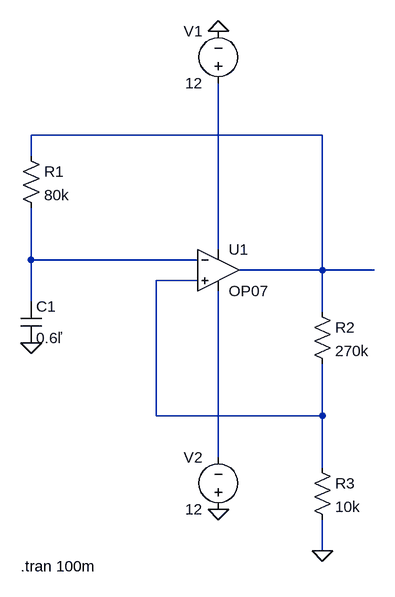
[diagram p0: schematic Square Wave Generator.asc]
Square Wave Generator.asc, the LTspice schematic file:
Version 4
SHEET 1 880 680
WIRE 432 -64 -16 -64
WIRE -16 -32 -16 -64
WIRE 272 112 272 -144
WIRE -16 128 -16 48
WIRE 240 128 -16 128
WIRE 432 144 432 -64
WIRE 432 144 304 144
WIRE 512 144 432 144
WIRE 240 160 176 160
WIRE -16 192 -16 128
WIRE 432 208 432 144
WIRE 176 368 176 160
WIRE 432 368 432 288
WIRE 432 368 176 368
WIRE 272 432 272 176
WIRE 432 448 432 368
WIRE 432 576 432 528
FLAG 432 576 0
FLAG 272 512 0
FLAG 272 -224 0
FLAG -16 256 0
SYMBOL OpAmps\\OP07 272 80 R0
SYMATTR InstName U1
SYMBOL cap -32 192 R0
SYMATTR InstName C1
SYMATTR Value 0.6ľ
SYMBOL res -32 -48 R0
SYMATTR InstName R1
SYMATTR Value 80k
SYMBOL res 416 192 R0
SYMATTR InstName R2
SYMATTR Value 270k
SYMBOL res 416 432 R0
SYMATTR InstName R3
SYMATTR Value 10k
SYMBOL voltage 272 -128 R180
WINDOW 0 24 96 Left 2
WINDOW 3 24 16 Left 2
WINDOW 123 0 0 Left 0
WINDOW 39 0 0 Left 0
SYMATTR InstName V1
SYMATTR Value 12
SYMBOL voltage 272 528 R180
WINDOW 0 24 96 Left 2
WINDOW 3 24 16 Left 2
WINDOW 123 0 0 Left 0
WINDOW 39 0 0 Left 0
SYMATTR InstName V2
SYMATTR Value 12
TEXT -32 600 Left 2 !.tran 100m

The netlist it stands for:
* Square Wave Generator.asc
XU1 N004 N003 N002 N005 N001 LT1001  ; OP07, pins In+ In- V+ V- OUT
C1 N003 0 0.6ľ
R1 N001 N003 80k
R2 N001 N004 270k
R3 N004 0 10k
V1 N002 0 12
V2 0 N005 12
.tran 100m
.lib LTC.lib
.backanno
.end